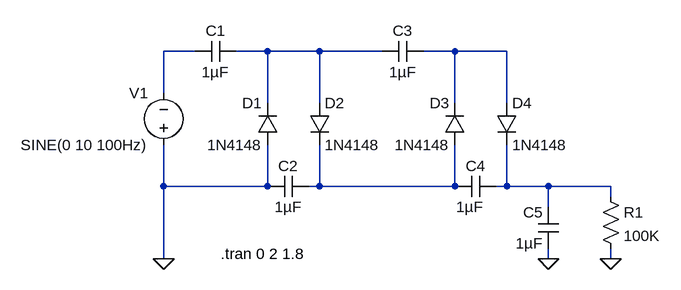
[diagram p0: schematic Exp2_Eva_P4.asc]
Exp2_Eva_P4.asc, the LTspice schematic file:
Version 4
SHEET 1 880 680
WIRE -112 -240 -160 -240
WIRE 0 -240 -48 -240
WIRE 80 -240 0 -240
WIRE 176 -240 80 -240
WIRE 288 -240 240 -240
WIRE 368 -240 288 -240
WIRE -160 -176 -160 -240
WIRE 0 -160 0 -240
WIRE 80 -160 80 -240
WIRE 288 -160 288 -240
WIRE 368 -160 368 -240
WIRE -160 -32 -160 -96
WIRE 0 -32 0 -96
WIRE 0 -32 -160 -32
WIRE 80 -32 80 -96
WIRE 80 -32 64 -32
WIRE 288 -32 288 -96
WIRE 288 -32 80 -32
WIRE 368 -32 368 -96
WIRE 368 -32 352 -32
WIRE 432 -32 368 -32
WIRE 528 -32 432 -32
WIRE 528 -16 528 -32
WIRE 432 0 432 -32
WIRE -160 80 -160 -32
WIRE 432 80 432 64
WIRE 528 80 528 64
FLAG 432 80 0
FLAG 528 80 0
FLAG -160 80 0
SYMBOL voltage -160 -80 R180
WINDOW 0 24 96 Left 2
WINDOW 3 24 16 Left 2
SYMATTR InstName V1
SYMATTR Value SINE(0 10 100Hz)
SYMBOL cap -48 -256 R90
WINDOW 0 0 32 VBottom 2
WINDOW 3 32 32 VTop 2
SYMATTR InstName C1
SYMATTR Value 1µF
SYMBOL diode 16 -96 R180
WINDOW 0 24 64 Left 2
WINDOW 3 24 0 Left 2
SYMATTR InstName D1
SYMATTR Value 1N4148
SYMBOL diode 64 -160 R0
SYMATTR InstName D2
SYMATTR Value 1N4148
SYMBOL diode 304 -96 R180
WINDOW 0 24 64 Left 2
WINDOW 3 24 0 Left 2
SYMATTR InstName D3
SYMATTR Value 1N4148
SYMBOL diode 352 -160 R0
SYMATTR InstName D4
SYMATTR Value 1N4148
SYMBOL cap 64 -48 R90
WINDOW 0 0 32 VBottom 2
WINDOW 3 32 32 VTop 2
SYMATTR InstName C2
SYMATTR Value 1µF
SYMBOL cap 240 -256 R90
WINDOW 0 0 32 VBottom 2
WINDOW 3 32 32 VTop 2
SYMATTR InstName C3
SYMATTR Value 1µF
SYMBOL cap 352 -48 R90
WINDOW 0 0 32 VBottom 2
WINDOW 3 32 41 VTop 2
SYMATTR InstName C4
SYMATTR Value 1µF
SYMBOL cap 448 64 R180
WINDOW 0 24 56 Left 2
WINDOW 3 24 8 Left 2
SYMATTR InstName C5
SYMATTR Value 1µF
SYMBOL res 512 -32 R0
SYMATTR InstName R1
SYMATTR Value 100K
TEXT -72 72 Left 2 !.tran 0 2 1.8

The netlist it stands for:
* Exp2_Eva_P4.asc
V1 0 N001 SINE(0 10 100Hz)
C1 N002 N001 1µF
D1 0 N002 1N4148
D2 N002 N004 1N4148
D3 N004 N003 1N4148
D4 N003 N005 1N4148
C2 N004 0 1µF
C3 N003 N002 1µF
C4 N005 N004 1µF
C5 0 N005 1µF
R1 N005 0 100K
.model D D
.lib standard.dio
.tran 0 2 1.8
.backanno
.end